# Altium schematic sheet SCNano-Main.SchDoc: SCNano Mainboard
size B; Engineer: Joseph Chiu; Organization: ToyBuilder Labs; Address1: 2736 E Walnut St; Address2: Pasadena, California 91107; Address4: +1 (626) 808-4010
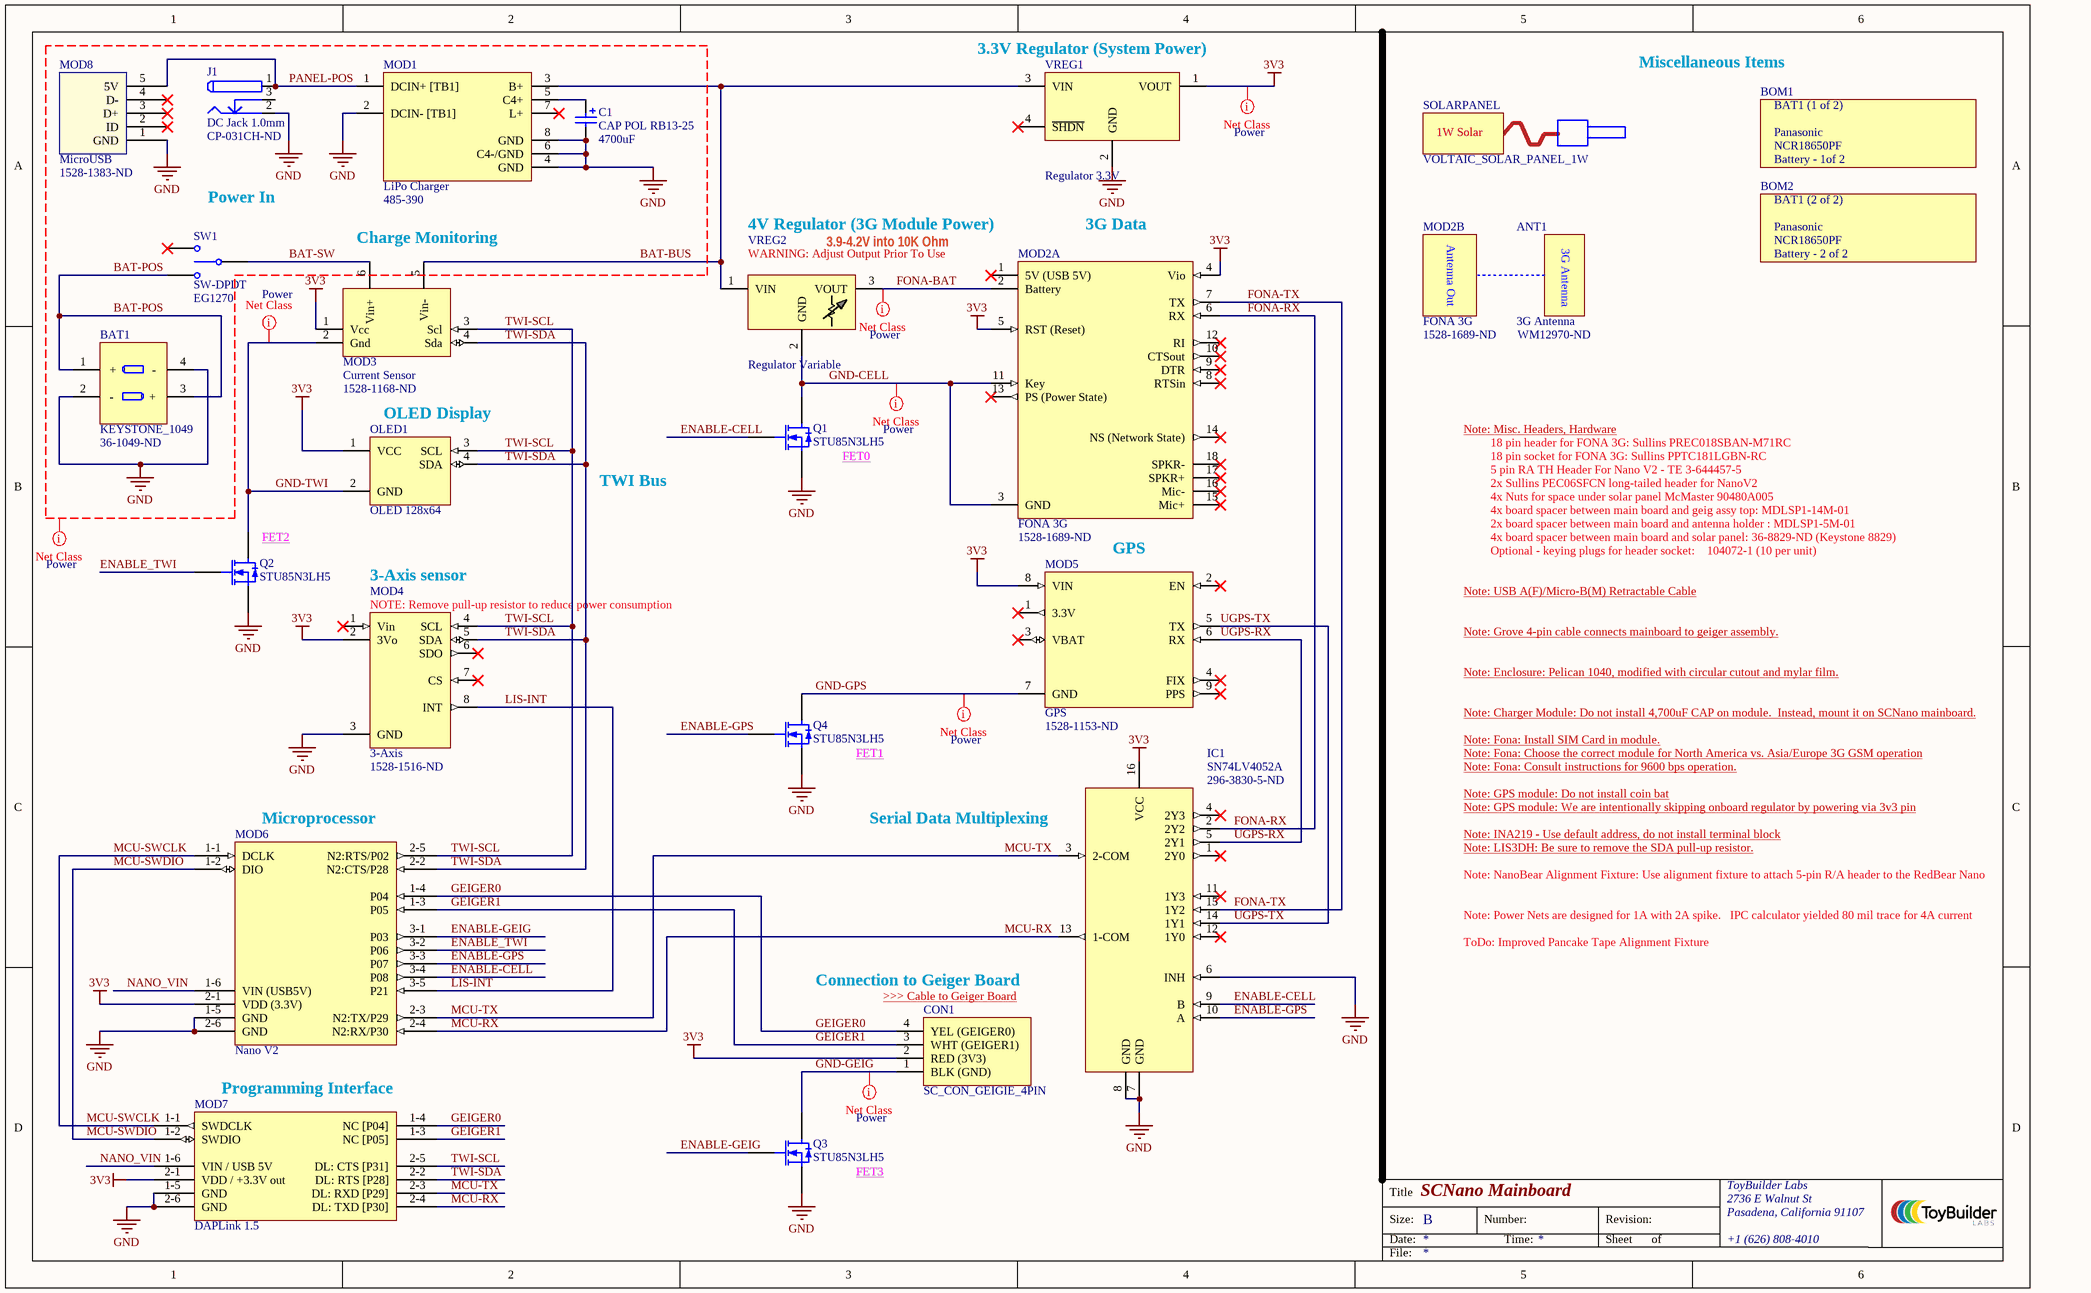
[diagram p0: SCNano-Main.SchDoc]

## Parts
ANT1  3G Antenna  Supplier Part Number 1: WM12970-ND  [MOLEX_146185-0100]
BAT1  KEYSTONE_1049  Supplier Part Number 1: 36-1049-ND  [Keystone 1049_R1]
BOM1  Battery - 1of 2  Manufacturer: Panasonic  Manufacturer Part Number: NCR18650PF  Location: BAT1 (1 of 2)  [BAT18650]
BOM2  Battery - 2 of 2  Manufacturer: Panasonic  Manufacturer Part Number: NCR18650PF  Location: BAT1 (2 of 2)  [BAT18650]
C1  CAP POL RB13-25  value 4700uF  [RB13-25]
CON1  SC_CON_GEIGIE_4PIN  [NSTECH 1125S]
IC1  SN74LV4052A  Supplier Part Number 1: 296-3830-5-ND  [N0016A]
J1  DC Jack 1.0mm  Supplier Part Number 1: CP-031CH-ND  [CUI_PJ-031CH]
MOD1  LiPo Charger  Supplier Part Number 1: 485-390  [ADAFRUIT 390]
MOD2  FONA 3G  Supplier Part Number 1: 1528-1689-ND  [ADAFRUIT 2687_RA]  (parts A,B of 2)
MOD3  Current Sensor  Supplier Part Number 1: 1528-1168-ND  [ADAFRUIT 904]
MOD4  3-Axis  Supplier Part Number 1: 1528-1516-ND  [ADAFRUIT_2809]
MOD5  GPS  Supplier Part Number 1: 1528-1153-ND  [ADAFRUIT 746]
MOD6  Nano V2  [REDBEAR NANO V2]
MOD7  DAPLink 1.5  [REDBEAR DAPLINK 1.5]
MOD8  MicroUSB  Supplier Part Number 1: 1528-1383-ND  [ADAFRUIT_1833]
OLED1  OLED 128x64  [IIC_OLED_960]
Q1  STU85N3LH5  [TO-251-3]
Q2  STU85N3LH5  [TO-251-3]
Q3  STU85N3LH5  [TO-251-3]
Q4  STU85N3LH5  [TO-251-3]
SOLARPANEL  VOLTAIC_SOLAR_PANEL_1W  [VOLTAIC_SOLAR_PANEL_1W]
SW1  SW-DPDT  [E-SWITCH EG1270]
VREG1  Regulator 3.3V  [POLOLU_2122]
VREG2  Regulator Variable  [POLOLU_791]

## Nets
3V3: CON1.2(RED_(3V3)) IC1.16(VCC) MOD2.4(Vio) MOD2.5(RST_(Reset)) MOD3.1(Vcc) MOD4.2(3Vo) MOD5.8(VIN) MOD6.2-1(VDD_(3.3V)) MOD7.2-1(VDD_/_+3.3V_out) OLED1.1(VCC) VREG1.1(VOUT)
GND: BAT1.2(-) BAT1.4(-) C1.2 IC1.6(INH) IC1.7(GND) IC1.8(GND) J1.2 MOD1.2(DCIN-_[TB1]) MOD1.4(GND) MOD1.6(C4-/GND) MOD1.8(GND) MOD4.3(GND) MOD6.1-5(GND) MOD6.2-6(GND) MOD7.1-5(GND) MOD7.2-6(GND) MOD8.1(GND) Q1.3(S) Q2.3(S) Q3.3(S) Q4.3(S) VREG1.2(GND)
BAT-BUS: MOD1.3(B+) MOD3.5(Vin-) VREG1.3(VIN) VREG2.1(VIN)
BAT-POS: BAT1.1(+) BAT1.3(+) SW1.1
BAT-SW: MOD3.6(Vin+) SW1.2
ENABLE-CELL: IC1.9(B) MOD6.3-4(P08) Q1.1(G)
ENABLE-GEIG: MOD6.3-1(P03) Q3.1(G)
ENABLE-GPS: IC1.10(A) MOD6.3-3(P07) Q4.1(G)
ENABLE_TWI: MOD6.3-2(P06) Q2.1(G)
FONA-BAT: MOD2.2(Battery) VREG2.3(VOUT)
FONA-RX: IC1.2(2Y2) MOD2.6(RX)
FONA-TX: IC1.15(1Y2) MOD2.7(TX)
GEIGER0: CON1.4(YEL_(GEIGER0)) MOD6.1-4(P04) MOD7.1-4(NC_[P04])
GEIGER1: CON1.3(WHT_(GEIGER1)) MOD6.1-3(P05) MOD7.1-3(NC_[P05])
GND-CELL: MOD2.3(GND) MOD2.11(Key) Q1.2(D) VREG2.2(GND)
GND-GEIG: CON1.1(BLK_(GND)) Q3.2(D)
GND-GPS: MOD5.7(GND) Q4.2(D)
GND-TWI: MOD3.2(Gnd) OLED1.2(GND) Q2.2(D)
LIS-INT: MOD4.8(INT) MOD6.3-5(P21)
MCU-RX: IC1.13(1-COM) MOD6.2-4(N2:RX/P30) MOD7.2-4(DL:_TXD_[P30])
MCU-SWCLK: MOD6.1-1(DCLK) MOD7.1-1(SWDCLK)
MCU-SWDIO: MOD6.1-2(DIO) MOD7.1-2(SWDIO)
MCU-TX: IC1.3(2-COM) MOD6.2-3(N2:TX/P29) MOD7.2-3(DL:_RXD_[P29])
NANO_VIN: MOD6.1-6(VIN_(USB5V)) MOD7.1-6(VIN_/_USB_5V)
PANEL-POS: J1.1 MOD1.1(DCIN+_[TB1]) MOD8.5(5V)
TWI-SCL: MOD3.3(Scl) MOD4.4(SCL) MOD6.2-5(N2:RTS/P02) MOD7.2-5(DL:_CTS_[P31]) OLED1.3(SCL)
TWI-SDA: MOD3.4(Sda) MOD4.5(SDA) MOD6.2-2(N2:CTS/P28) MOD7.2-2(DL:_RTS_[P28]) OLED1.4(SDA)
UGPS-RX: IC1.5(2Y1) MOD5.6(RX)
UGPS-TX: IC1.14(1Y1) MOD5.5(TX)
NetC1_1: C1.1 MOD1.5(C4+)

Not connected (* = marked no-connect by the designer): IC1 1(2Y0)* 4(2Y3)* 11(1Y3)* 12(1Y0)*; J1 3; MOD1 7(L+)*; MOD2 1(5V_(USB_5V))* 8(RTSin)* 9(DTR)* 10(CTSout)* 12(RI)* 13(PS_(Power_State))* 14(NS_(Network_State))* 15(Mic+)* 16(Mic-)* 17(SPKR+)* 18(SPKR-)*; MOD4 1(Vin)* 6(SDO)* 7(CS)*; MOD5 1(3.3V)* 2(EN)* 3(VBAT)* 4(FIX)* 9(PPS)*; MOD8 2(ID)* 3(D+)* 4(D-)*; SW1 3*; VREG1 4(~{SHDN})*

## Layout directives
net class Power: 3V3, BAT-BUS, BAT-POS, BAT-SW, FONA-BAT, GND, GND-CELL, GND-GEIG, GND-GPS, GND-TWI, PANEL-POS

## Notes on the sheet
- (near VREG1) 3.3V Regulator (System Power)
- Miscellaneous Items
- (near SW1) Power In
- 4V Regulator (3G Module Power)
- 3.9-4.2V into 10K Ohm
- (near MOD2) 3G Data
- Charge Monitoring
- (near OLED1) OLED Display
- Note: Misc. Headers, Hardware
- TWI Bus
- (near Q1) FET0
- 18 pin socket for FONA 3G: Sullins PPTC181LGBN-RC
- 5 pin RA TH Header For Nano V2 - TE 3-644457-5
- 4x Nuts for space under solar panel McMaster 90480A005
- 2x Sullins PEC06SFCN long-tailed header for NanoV2
- 18 pin header for FONA 3G: Sullins PREC018SBAN-M71RC
- (near Q2) FET2
- GPS
- 4x board spacer between main board and geig assy top: MDLSP1-14M-01
- 2x board spacer between main board and antenna holder : MDLSP1-5M-01
- 4x board spacer between main board and solar panel: 36-8829-ND (Keystone 8829)
- Optional - keying plugs for header socket:    104072-1 (10 per unit)
- (near MOD4) 3-Axis sensor
- Note: USB A(F)/Micro-B(M) Retractable Cable
- Note: Grove 4-pin cable connects mainboard to geiger assembly.
- Note: Enclosure: Pelican 1040, modified with circular cutout and mylar film.
- FET1
- Note: Fona: Install SIM Card in module.
- Note: Fona: Choose the correct module for North America vs. Asia/Europe 3G GSM operation
- Note: Charger Module: Do not install 4,700uF CAP on module.  Instead, mount it on SCNano mainboard.
- Note: Fona: Consult instructions for 9600 bps operation.
- (near MOD6) Microprocessor
- (near IC1) Serial Data Multiplexing
- Note: GPS module: Do not install coin bat
- Note: GPS module: We are intentionally skipping onboard regulator by powering via 3v3 pin
- Note: INA219 - Use default address, do not install terminal block
- Note: LIS3DH: Be sure to remove the SDA pull-up resistor.
- Note: NanoBear Alignment Fixture: Use alignment fixture to attach 5-pin R/A header to the RedBear Nano
- ToDo: Improved Pancake Tape Alignment Fixture
- Note: Power Nets are designed for 1A with 2A spike.   IPC calculator yielded 80 mil trace for 4A current
- Connection to Geiger Board
- (near CON1) >>> Cable to Geiger Board
- (near MOD7) Programming Interface
- FET3
- Title
- Size:
- Date:
- B
- Number:
- Time:
- Revision:
- Sheet
- of
- File:
- (in symbol ADAFRUIT_2687_2691, part B) Antenna Out
- (in symbol ADAFRUIT_2809) NOTE: Remove pull-up resistor to reduce power consumption
- (in symbol POLULU_791) WARNING: Adjust Output Prior To Use
- (in symbol VOLTAIC_SOLAR_PANEL_1W) 1W Solar

## Library data of the parts
ANT1 = MOLEX_146185-0100: Antenna, Cellular Radio, 3G; Manufacturer: Molex, LLC; Manufacturer Part Number: 1461850100; Frequency Group: Wide Band; Frequency (Center/Band): 892MHz, 1.9GHz, 4.5GHz; Frequency Range: 824MHz ~ 960MHz, 1.71GHz ~ 2.7GHz, 3GHZ ~ 6GHz; Antenna Type: Flat Patch; Return Loss: -6dB; Gain: 4dBi; Supplier 1: Digi-Key; RoHS: RoHS Compliant; Category: RF/IF and RFID; Stock 1: 1135; Pricing 1: 1=3.45, 10=3.081, 25=2.7724, 100=2.526, 250=2.27956, 500=2.04546, 1000=1.72508, 2500=1.63883, 5000=1.57722 (USD); Packaging: Bulk; Part Status: Active; VSWR: -; Features: -; Termination: Connector, MMCX Male; Ingress Protection: -; Mounting Type: Adhesive; Height (Max): -; Applications: WLAN; ComponentLink1URL: http://www.molex.com/pdm_docs/sd/1461850100_sd.pdf; ComponentLink1Description: http://www.molex.com/pdm_docs/sd/1461850100_sd.pdf
BAT1 = KEYSTONE_1049: Battery Holder, 2x18650, T/H; Manufacturer: Keystone Electronics; Manufacturer Part Number: 1049; Battery Type, Function: Cylindrical, Holder; Style: Holder (Open); Battery Cell Size: 18650; Number of Cells: 2; Supplier 1: Digi-Key; RoHS: RoHS Compliant; Category: Battery Products; Stock 1: 2954; Pricing 1: 1=4.48, 10=3.733, 50=3.2666, 100=3.111, 250=2.72212, 2500=2.33352 (USD); Part Status: Active; Battery Series: -; Mounting Type: PCB, Through Hole; Termination Style: PC Pin; Height Above Board: 0.585" (14.86mm); Operating Temperature: -50°C ~ 145°C; ComponentLink1URL: http://www.keyelco.com/product-pdf.cfm?p=921; ComponentLink1Description: http://www.keyelco.com/product-pdf.cfm?p=921
BOM1 BOM2 = BOM Entry: Additional BOM Item; Supplier 1: Amazon; Supplier Part Number 1: B00F58URPK
C1 = CAP POL RB13-25: Polarized Capacitor (Radial); Published: 8-Jun-2000; LatestRevisionDate: 17-Jul-2002; LatestRevisionNote: Re-released for DXP Platform.; PackageReference: RB7.6-15; Publisher: Altium Limited; PackageDescription: Polarized Capacitor (Radial); 2 Leads
CON1 = SC_CON_GEIGIE_4PIN: Grove 4 Pin Connector Female T/H, labeled for Safecast Geiegie products; Manufacturer: Grove; Manufacturer Part Number: 4 Pin Connector
IC1 = SN74LV4052A: Dual 4-Channel Analog Multiplexer/Demultiplexer DIP-16; Manufacturer: Texas Instruments; Manufacturer Part Number: SN74LV4052AN; Switch Circuit: SP4T; Multiplexer/Demultiplexer Circuit: 4:1; On-State Resistance (Max): 75 Ohm; Channel-to-Channel Matching (&Delta;Ron): 700 mOhm; Voltage - Supply, Single (V+): 2 V ~ 5.5 V; Switch Time (Ton, Toff) (Max): 14ns, 14ns; -3db Bandwidth: 50MHz; Channel Capacitance (CS(off), CD(off)): 0.5pF, 13.1pF; Current - Leakage (IS(off)) (Max): 100nA; Crosstalk: -45dB @ 1MHz; Supplier 1: Digi-Key; RoHS: RoHS Compliant; Category: Integrated Circuits (ICs); Stock 1: 958; Pricing 1: 1=0.5, 10=0.428, 100=0.3192, 500=0.2508, 1000=0.1938 (USD); Packaging: Tube; Part Status: Active; Voltage - Supply, Dual (V±): -; Charge Injection: -; Operating Temperature: -40°C ~ 85°C (TA); Package / Case: 16-DIP (0.300", 7.62mm); Supplier Device Package: 16-PDIP; ComponentLink1URL: http://www.ti.com/lit/ds/symlink/sn74lv4052a.pdf; ComponentLink1Description: http://www.ti.com/lit/ds/symlink/sn74lv4052a.pdf
J1 = CUI_PJ-031CH: DC Jack, 1.0 x 3.4 mm (for 1.1 x 3.5 mm plug). T/H; Manufacturer: CUI Inc.; Gender: Male; Industry Recognized Mating Diameter: 1.00mm ID (0.039"), 3.40mm OD (0.134"); Actual Diameter: 0.039" (1.00mm ID), 0.165" (4.20mm OD); Number of Positions/Contacts: 2 Conductors, 3 Contacts; Internal Switch(s): Single Switch, Normally Closed; Shielding: Unshielded; Voltage - Rated: 24VDC; Current Rating: 3.5A; Mating Length/Depth: 0.260" (6.60mm); Body Color: Black; Material Flammability Rating: UL94 V-0; Published: 17-Dec-2003; DatasheetDocument: 09-May-2002; Publisher: Altium Limited; ComponentLink1Description: Manufacturer Link; ComponentLink1URL: http://domino.kycon.com/internet/Products.html; Supplier 1: Digi-Key; Manufacturer Part Number: PJ-031CH; RoHS: RoHS Compliant; Category: Connectors, Interconnects; Stock 1: 3924; Pricing 1: 1=0.71, 10=0.666, 25=0.5996, 50=0.5328, 100=0.5106, 250=0.4662, 500=0.444, 1000=0.3663, 2500=0.333 (USD); Packaging: Bulk; Part Status: Active; Connector Type: Jack; Mounting Type: Through Hole, Right Angle; Mounting Feature: -; Termination: Solder; Features: -; Insulation Color: -; Contact Material - Plating: Silver; Body Material: -; Operating Temperature: -25°C ~ 85°C; Includes: -; Housing Material: Polybutylene Terephthalate (PBT); Contact Material: Brass; Copper Alloy; Thread Size: -; Ingress Protection: -; ComponentLink2URL: http://www.cui.com/product/resource/digikeypdf/pj-031ch.pdf; ComponentLink2Description: http://www.cui.com/product/resource/digikeypdf/pj-031ch.pdf
MOD1 = ADAFRUIT_390: Adafruit DC / Solar Lithium Ion/Polymer charger - v2; Manufacturer: Adafruit Industries LLC; Manufacturer Part Number: 390; Supplier 1: Mouser; RoHS: RoHS Compliant; Category: Power Management IC Development Tools; Stock 1: 195; Pricing 1: 1=17.50 (USD); Brand: Adafruit; Standard Pack Qty: 1; RoHS - Mouser: Y; Minimum Order Quantity: 1; Reeling: False; ComponentLink1URL: https://cdn-learn.adafruit.com/downloads/pdf/usb-dc-and-solar-lipoly-charger.pdf; ComponentLink1Description: https://cdn-learn.adafruit.com/downloads/pdf/usb-dc-and-solar-lipoly-charger.pdf
MOD2 = ADAFRUIT_2687_2691: Adafruit FONA 3G Cellular + GPS Breakout; Manufacturer: Adafruit Industries LLC; Manufacturer Part Number: 2687; Frequency: 850MHz, 900MHz, 1.8GHz, 1.9GHz; For Use With/Related Products: SIM808; Supplied Contents: Board; Supplier 1: Digi-Key; RoHS: RoHS Compliant; Category: RF/IF and RFID; Stock 1: 0; Pricing 1: 1=79.95 (USD); Part Status: Active; Type: Cellular Development Platform; ComponentLink1URL: https://cdn-learn.adafruit.com/downloads/pdf/adafruit-fona-3g-cellular-gps-breakout.pdf; ComponentLink1Description: https://cdn-learn.adafruit.com/downloads/pdf/adafruit-fona-3g-cellular-gps-breakout.pdf
MOD3 = ADAFRUIT_904: Adafruit INA219 High Side DC Current Sensor Breakout; Manufacturer: Adafruit Industries LLC; Manufacturer Part Number: 904; Utilized IC / Part: INA219B; Main Purpose: Power Management, Current Monitor; Supplied Contents: Board(s); Supplier 1: Digi-Key; RoHS: RoHS Compliant; Category: Development Boards, Kits, Programmers; Stock 1: 358; Pricing 1: 1=9.95 (USD); Part Status: Active; Embedded: -; Primary Attributes: -; Secondary Attributes: -; ComponentLink1URL: http://media.digikey.com/pdf/Data%20Sheets/Adafruit%20PDFs/904_Web.pdf; ComponentLink1Description: http://media.digikey.com/pdf/Data%20Sheets/Adafruit%20PDFs/904_Web.pdf
MOD4 = ADAFRUIT_2809: Adafruit high-resolution ultra low-power triaxial (3-axis) accelerometer module (LIS3DH); Manufacturer: Adafruit Industries LLC; Manufacturer Part Number: 2809; Sensor Type: Accelerometer, 3 Axis; Sensing Range: ±2g, 4g, 8g, 16g; Interface: I²C, SPI; Sensitivity: 1mg/digit, 2mg/digit, 4mg/digit, 12mg/digit; Voltage - Supply: 3 V ~ 5 V; Supplied Contents: Board(s); Supplier 1: Digi-Key; RoHS: Not Applicable; Category: Development Boards, Kits, Programmers; Stock 1: 405; Pricing 1: 1=4.95 (USD); Part Status: Active; Embedded: -; Utilized IC / Part: LIS3DH; ComponentLink1URL: https://learn.adafruit.com/downloads/pdf/adafruit-lis3dh-triple-axis-accelerometer-breakout.pdf; ComponentLink1Description: https://learn.adafruit.com/downloads/pdf/adafruit-lis3dh-triple-axis-accelerometer-breakout.pdf; ComponentLink2Description: Sensor Datasheet https://cdn-shop.adafruit.com/datasheets/LIS3DH.pdf; ComponentLink2URL: https://cdn-shop.adafruit.com/datasheets/LIS3DH.pdf
MOD5 = ADAFRUIT_746: Adafruit Ultimate GPS Breakout - 66 channel w/10 Hz updates - Version 3; Manufacturer: Adafruit Industries LLC; Manufacturer Part Number: 746; Frequency: 1575.42MHz; For Use With/Related Products: MTK3339; Supplied Contents: Board; Supplier 1: Digi-Key; RoHS: RoHS Compliant; Category: RF/IF and RFID; Stock 1: 1625; Pricing 1: 1=39.95 (USD); Part Status: Active; Type: GPS; ComponentLink1URL: http://media.digikey.com/pdf/Data%20Sheets/Adafruit%20PDFs/746_Web.pdf; ComponentLink1Description: http://media.digikey.com/pdf/Data%20Sheets/Adafruit%20PDFs/746_Web.pdf
MOD6 = REDBEAR_NANO_V2PLUS: Redbear Nano V2 Plus - nRF52832 processor module; ComponentLink1Description: https://www.seeedstudio.com/RedBear-BLE-Nano-V2-p-2837.html; ComponentLink1URL: https://www.seeedstudio.com/RedBear-BLE-Nano-V2-p-2837.html; Manufacturer: RedBear; Manufacturer Part Number: Nano V2 Plus; Supplier 1: Sparkfun; Supplier Part Number 1: WRL-14154
MOD7 = REDBEAR_DAPLINK_1_5: Redbear DAPLink 1.5 (included in purchase with BLE Nano); ComponentLink1Description: https://www.seeedstudio.com/RedBear-BLE-Nano-Kit-V2--p-2836.html; ComponentLink1URL: https://www.seeedstudio.com/RedBear-BLE-Nano-Kit-V2--p-2836.html; Manufacturer: RedBear; Manufacturer Part Number: Daplink 1.5; Supplier 1: Sparkfun; Supplier Part Number 1: WRL-14154
MOD8 = ADAFRUIT_1833: Adafruit 1833 MicroUSB Breakout Module; Manufacturer: Adafruit Industries LLC; Manufacturer Part Number: 1833; Proto Board Type: Connector to Plated Through Hole; Package Accepted: USB - micro B; Number of Positions: 5; Board Thickness: 0.040" (1.02mm) 1/25"; Supplier 1: Digi-Key; RoHS: RoHS Compliant; Category: Prototyping Products; Stock 1: 970; Pricing 1: 1=1.5 (USD); Part Status: Active; Pitch: -; Material: -; Size / Dimension: 0.787" L x 0.394" W (20.00mm x 10.00mm); ComponentLink1URL: http://media.digikey.com/pdf/Data%20Sheets/Adafruit%20PDFs/1833_Web.pdf; ComponentLink1Description: http://media.digikey.com/pdf/Data%20Sheets/Adafruit%20PDFs/1833_Web.pdf
OLED1 = IIC_OLED_960: IIC 0.96" Inches White I2C 128x64 OLED LCD Display Module, with VCC on pin 1; Manufacturer: Acrobotic; Manufacturer Part Number: DIS-00003; ComponentLink1Description: https://acrobotic.com/dis-00003; ComponentLink1URL: https://acrobotic.com/dis-00003; Supplier 1: Acrobotic; Supplier Part Number 1: DIS-00003
Q1-Q4 = STU85N3LH5: MOSFET N-channel 30V (the easy to handle IPAK version) carefully chosen for high-current Fona, and is a very flexible part); Manufacturer: STMicroelectronics; Manufacturer Part Number: STU85N3LHS; Current - Continuous Drain (Id) @ 25°C: 80A (Tc); Drive Voltage (Max Rds On,  Min Rds On): 5V, 10V; Vgs(th) (Max) @ Id: 2.5V @ 250µA; Gate Charge (Qg) (Max) @ Vgs: 14nC @ 5V; Input Capacitance (Ciss) (Max) @ Vds: 1850pF @ 25V; Vgs (Max): ±22V; Power Dissipation (Max): 70W (Tc); Rds On (Max) @ Id, Vgs: 5.4 mOhm @ 40A, 10V; ComponentLink1Description: http://www.st.com/content/ccc/resource/technical/document/datasheet/00/4c/c5/6c/36/f9/44/2b/CD00168872.pdf/files/CD00168872.pdf/jcr:content/translations/en.CD00168872.pdf; ComponentLink1URL: http://www.st.com/content/ccc/resource/technical/document/datasheet/00/4c/c5/6c/36/f9/44/2b/CD00168872.pdf/files/CD00168872.pdf/jcr:content/translations/en.CD00168872.pdf; Supplier 1: Digi-Key; RoHS: RoHS Compliant; Category: Discrete Semiconductor Products; Stock 1: 202; Pricing 1: 1=1.52, 10=1.363, 100=1.0626, 500=0.8778, 1000=0.693 (USD); Packaging: Tube; Part Status: Active; FET Type: N-Channel; Technology: MOSFET (Metal Oxide); FET Feature: -; Operating Temperature: 175°C (TJ); Mounting Type: Through Hole; Supplier Device Package: I-Pak; Package / Case: TO-251-3 Short Leads, IPak, TO-251AA; Supplier Part Number 1: 497-12702-5-ND
SOLARPANEL = VOLTAIC_SOLAR_PANEL_1W: 1 Watt Solar Panel; ComponentLink1Description: https://www.voltaicsystems.com/1-watt-panel; ComponentLink1URL: https://www.voltaicsystems.com/1-watt-panel; Manufacturer: Voltaic; Manufacturer Part Number: 1 Watt Solar Panel
SW1 = EG1270: SWITCH SLIDE DPDT 200MA 30V; Manufacturer: E-Switch; Current Rating: 300mA; Actuator Length: 2mm; Electrical Life: 10000Cycles; Operating Force: 200gf; Voltage Rating (AC): 500V; Voltage Rating (DC): 6V; Throw Configuration: SPDT; Illumination Type: Non-Illuminated; Contact Style: Non-Shorting; Number of Positions: 2; Manufacturer Part Number: EG1270; Supplier 1: Onlinecomponents.com; Stock 1: 236; Pricing 1: 1=0.68, 25=0.64, 100=0.61, 500=0.456, 1000=0.411, 2500=0.368, 5000=0.325, 10000=0.314 (USD); Packaging: Bulk; Contact Material: Copper,Silver; Switch Travel: 2mm; ComponentLink1URL: https://datasheet.ciiva.com/6967/p040045b-6967522.pdf; ComponentLink1Description: https://datasheet.ciiva.com/6967/p040045b-6967522.pdf; Supplier Part Number 1: EG1270; Mount: Through Hole,Brackets; Contact Plating: Silver; Min Operating Temperature: -20°C; Max Operating Temperature: 70°C; Package Quantity: 1000; Contact Current Rating: 300mA; Termination: PC Pin; Orientation: Right Angle; REACH SVHC: No SVHC; Lead Free: Lead Free; ComponentLink2URL: https://datasheet.ciiva.com/16174/p040045-16174262.pdf; ComponentLink2Description: https://datasheet.ciiva.com/16174/p040045-16174262.pdf; ComponentLink3URL: https://datasheet.ciiva.com/2889/p040045-2889384.pdf; ComponentLink3Description: https://datasheet.ciiva.com/2889/p040045-2889384.pdf
VREG1 = POLOLU_2122: Pololu 3.3V Step-Up/Step-Down Voltage Regulator Module (S7V8F3); Manufacturer: Pololou; Manufacturer Part Number: 2122; ComponentLink1Description: https://www.pololu.com/product/2122; ComponentLink1URL: https://www.pololu.com/product/2122; Supplier 1: Pololou; Supplier Part Number 1: 2122
VREG2 = POLULU_791: Pololu Adjustable Boost Regulator Module (2.5-9.5V); Manufacturer: Pololou; Manufacturer Part Number: 791; ComponentLink1Description: https://www.pololu.com/product/791; ComponentLink1URL: https://www.pololu.com/product/791; Supplier 1: Pololou; Supplier Part Number 1: 791